# EAGLE design Ultrasonic Array_8x8 (EAGLE 6.3)
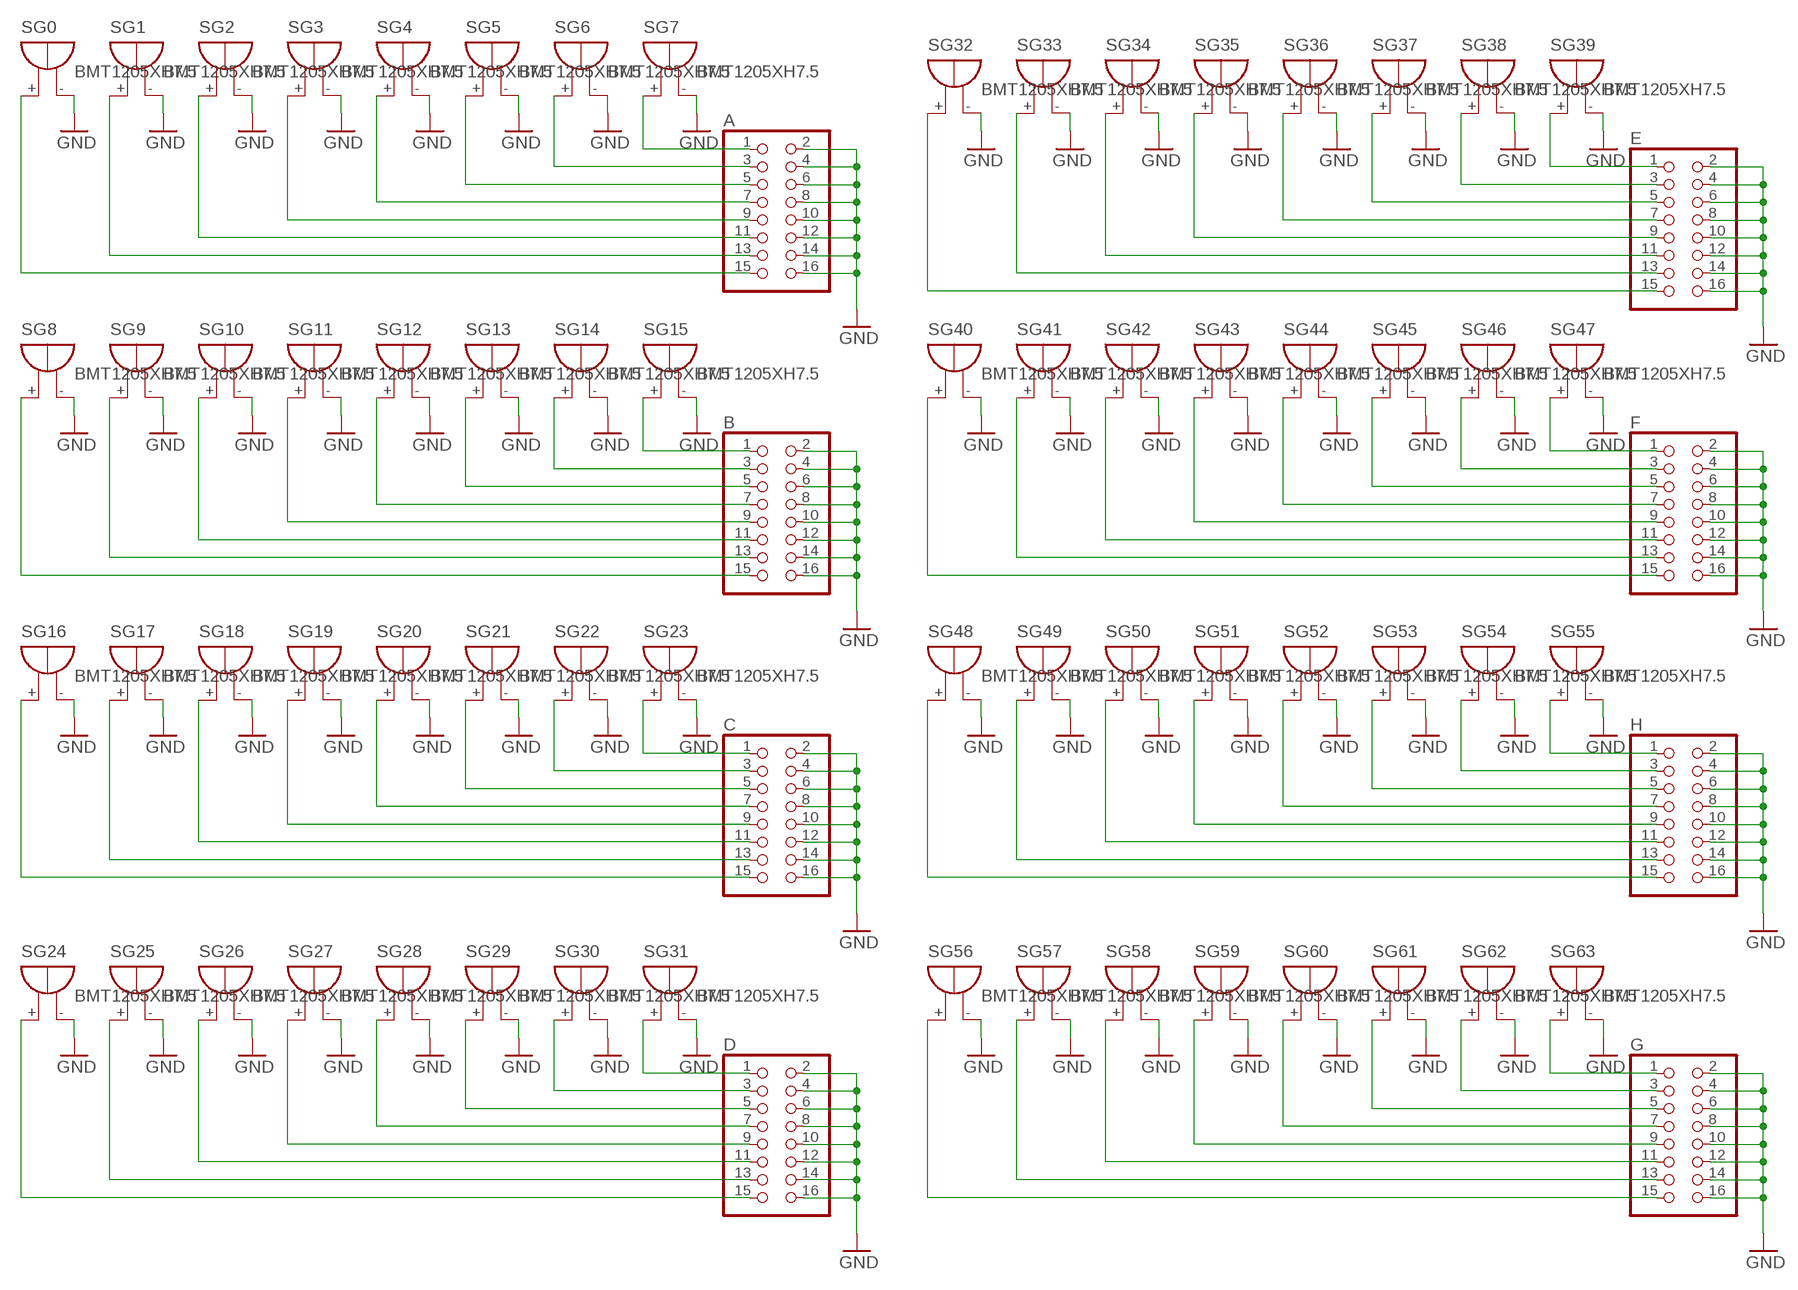
[diagram p0: schematic, sheet 1]

## Parts
A  PINHD-2X8  [2X08]
B  PINHD-2X8  [2X08]
C  PINHD-2X8  [2X08]
D  PINHD-2X8  [2X08]
E  PINHD-2X8  [2X08]
F  PINHD-2X8  [2X08]
G  PINHD-2X8  [2X08]
H  PINHD-2X8  [2X08]
SG0  BMT1205XH7.5  [BMT1205XH7.5]
SG1  BMT1205XH7.5  [BMT1205XH7.5]
SG2  BMT1205XH7.5  [BMT1205XH7.5]
SG3  BMT1205XH7.5  [BMT1205XH7.5]
SG4  BMT1205XH7.5  [BMT1205XH7.5]
SG5  BMT1205XH7.5  [BMT1205XH7.5]
SG6  BMT1205XH7.5  [BMT1205XH7.5]
SG7  BMT1205XH7.5  [BMT1205XH7.5]
SG8  BMT1205XH7.5  [BMT1205XH7.5]
SG9  BMT1205XH7.5  [BMT1205XH7.5]
SG10  BMT1205XH7.5  [BMT1205XH7.5]
SG11  BMT1205XH7.5  [BMT1205XH7.5]
SG12  BMT1205XH7.5  [BMT1205XH7.5]
SG13  BMT1205XH7.5  [BMT1205XH7.5]
SG14  BMT1205XH7.5  [BMT1205XH7.5]
SG15  BMT1205XH7.5  [BMT1205XH7.5]
SG16  BMT1205XH7.5  [BMT1205XH7.5]
SG17  BMT1205XH7.5  [BMT1205XH7.5]
SG18  BMT1205XH7.5  [BMT1205XH7.5]
SG19  BMT1205XH7.5  [BMT1205XH7.5]
SG20  BMT1205XH7.5  [BMT1205XH7.5]
SG21  BMT1205XH7.5  [BMT1205XH7.5]
SG22  BMT1205XH7.5  [BMT1205XH7.5]
SG23  BMT1205XH7.5  [BMT1205XH7.5]
SG24  BMT1205XH7.5  [BMT1205XH7.5]
SG25  BMT1205XH7.5  [BMT1205XH7.5]
SG26  BMT1205XH7.5  [BMT1205XH7.5]
SG27  BMT1205XH7.5  [BMT1205XH7.5]
SG28  BMT1205XH7.5  [BMT1205XH7.5]
SG29  BMT1205XH7.5  [BMT1205XH7.5]
SG30  BMT1205XH7.5  [BMT1205XH7.5]
SG31  BMT1205XH7.5  [BMT1205XH7.5]
SG32  BMT1205XH7.5  [BMT1205XH7.5]
SG33  BMT1205XH7.5  [BMT1205XH7.5]
SG34  BMT1205XH7.5  [BMT1205XH7.5]
SG35  BMT1205XH7.5  [BMT1205XH7.5]
SG36  BMT1205XH7.5  [BMT1205XH7.5]
SG37  BMT1205XH7.5  [BMT1205XH7.5]
SG38  BMT1205XH7.5  [BMT1205XH7.5]
SG39  BMT1205XH7.5  [BMT1205XH7.5]
SG40  BMT1205XH7.5  [BMT1205XH7.5]
SG41  BMT1205XH7.5  [BMT1205XH7.5]
SG42  BMT1205XH7.5  [BMT1205XH7.5]
SG43  BMT1205XH7.5  [BMT1205XH7.5]
SG44  BMT1205XH7.5  [BMT1205XH7.5]
SG45  BMT1205XH7.5  [BMT1205XH7.5]
SG46  BMT1205XH7.5  [BMT1205XH7.5]
SG47  BMT1205XH7.5  [BMT1205XH7.5]
SG48  BMT1205XH7.5  [BMT1205XH7.5]
SG49  BMT1205XH7.5  [BMT1205XH7.5]
SG50  BMT1205XH7.5  [BMT1205XH7.5]
SG51  BMT1205XH7.5  [BMT1205XH7.5]
SG52  BMT1205XH7.5  [BMT1205XH7.5]
SG53  BMT1205XH7.5  [BMT1205XH7.5]
SG54  BMT1205XH7.5  [BMT1205XH7.5]
SG55  BMT1205XH7.5  [BMT1205XH7.5]
SG56  BMT1205XH7.5  [BMT1205XH7.5]
SG57  BMT1205XH7.5  [BMT1205XH7.5]
SG58  BMT1205XH7.5  [BMT1205XH7.5]
SG59  BMT1205XH7.5  [BMT1205XH7.5]
SG60  BMT1205XH7.5  [BMT1205XH7.5]
SG61  BMT1205XH7.5  [BMT1205XH7.5]
SG62  BMT1205XH7.5  [BMT1205XH7.5]
SG63  BMT1205XH7.5  [BMT1205XH7.5]

## Nets
GND: A.2 A.4 A.6 A.8 A.10 A.12 A.14 A.16 B.2 B.4 B.6 B.8 B.10 B.12 B.14 B.16 C.2 C.4 C.6 C.8 C.10 C.12 C.14 C.16 D.2 D.4 D.6 D.8 D.10 D.12 D.14 D.16 E.2 E.4 E.6 E.8 E.10 E.12 E.14 E.16 F.2 F.4 F.6 F.8 F.10 F.12 F.14 F.16 G.2 G.4 G.6 G.8 G.10 G.12 G.14 G.16 H.2 H.4 H.6 H.8 H.10 H.12 H.14 H.16 SG0.- SG1.- SG2.- SG3.- SG4.- SG5.- SG6.- SG7.- SG8.- SG9.- SG10.- SG11.- SG12.- SG13.- SG14.- SG15.- SG16.- SG17.- SG18.- SG19.- SG20.- SG21.- SG22.- SG23.- SG24.- SG25.- SG26.- SG27.- SG28.- SG29.- SG30.- SG31.- SG32.- SG33.- SG34.- SG35.- SG36.- SG37.- SG38.- SG39.- SG40.- SG41.- SG42.- SG43.- SG44.- SG45.- SG46.- SG47.- SG48.- SG49.- SG50.- SG51.- SG52.- SG53.- SG54.- SG55.- SG56.- SG57.- SG58.- SG59.- SG60.- SG61.- SG62.- SG63.-
N$1: A.1 SG7.+
N$2: A.3 SG6.+
N$3: A.5 SG5.+
N$4: A.7 SG4.+
N$5: A.9 SG3.+
N$6: A.11 SG2.+
N$7: A.13 SG1.+
N$8: A.15 SG0.+
N$17: B.1 SG15.+
N$18: B.3 SG14.+
N$19: B.5 SG13.+
N$20: B.7 SG12.+
N$21: B.9 SG11.+
N$22: B.11 SG10.+
N$23: B.13 SG9.+
N$24: B.15 SG8.+
N$34: C.1 SG23.+
N$35: C.3 SG22.+
N$36: C.5 SG21.+
N$37: C.7 SG20.+
N$38: C.9 SG19.+
N$39: C.11 SG18.+
N$40: C.13 SG17.+
N$41: C.15 SG16.+
N$50: D.1 SG31.+
N$51: D.3 SG30.+
N$52: D.5 SG29.+
N$53: D.7 SG28.+
N$54: D.9 SG27.+
N$55: D.11 SG26.+
N$56: D.13 SG25.+
N$57: D.15 SG24.+
N$66: E.1 SG39.+
N$67: E.3 SG38.+
N$68: E.5 SG37.+
N$69: E.7 SG36.+
N$70: E.9 SG35.+
N$71: E.11 SG34.+
N$72: E.13 SG33.+
N$73: E.15 SG32.+
N$82: F.1 SG47.+
N$83: F.3 SG46.+
N$84: F.5 SG45.+
N$85: F.7 SG44.+
N$86: F.9 SG43.+
N$87: F.11 SG42.+
N$88: F.13 SG41.+
N$89: F.15 SG40.+
N$98: H.1 SG55.+
N$99: H.3 SG54.+
N$100: H.5 SG53.+
N$101: H.7 SG52.+
N$102: H.9 SG51.+
N$103: H.11 SG50.+
N$104: H.13 SG49.+
N$105: H.15 SG48.+
N$114: G.1 SG63.+
N$115: G.3 SG62.+
N$116: G.5 SG61.+
N$117: G.7 SG60.+
N$118: G.9 SG59.+
N$119: G.11 SG58.+
N$120: G.13 SG57.+
N$121: G.15 SG56.+

## Library data of the parts
A B C D E F G H = pinhead:PINHD-2X8: PIN HEADER
SG0 SG1-SG63 = buzzer_custom:BMT1205XH7.5: MAGNETIC TRANSDUCER Source: Http:www.be-star.com; OC_FARNELL: unknown; OC_NEWARK: unknown

## Board
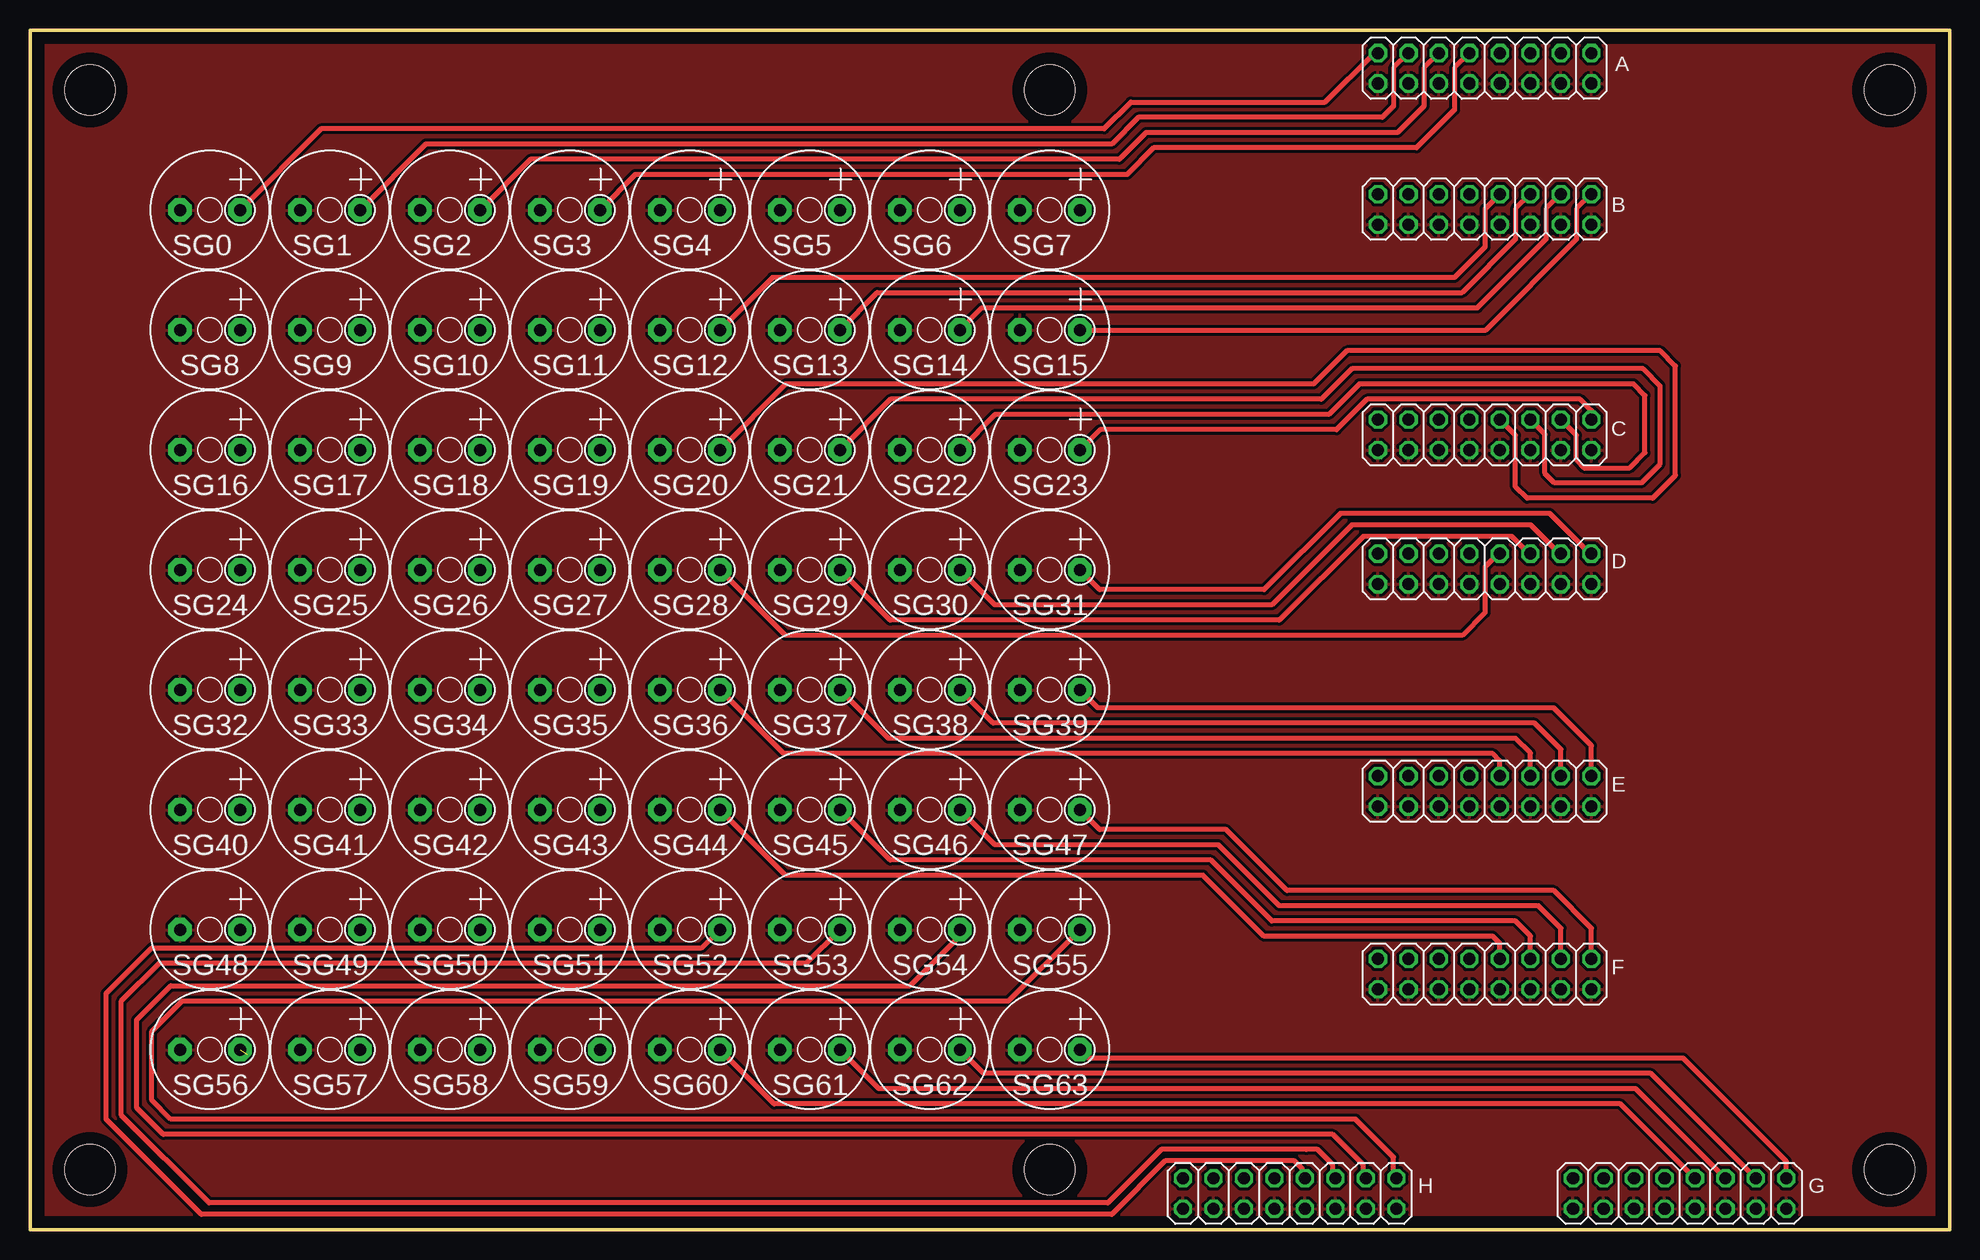
[diagram p1: board, top side]
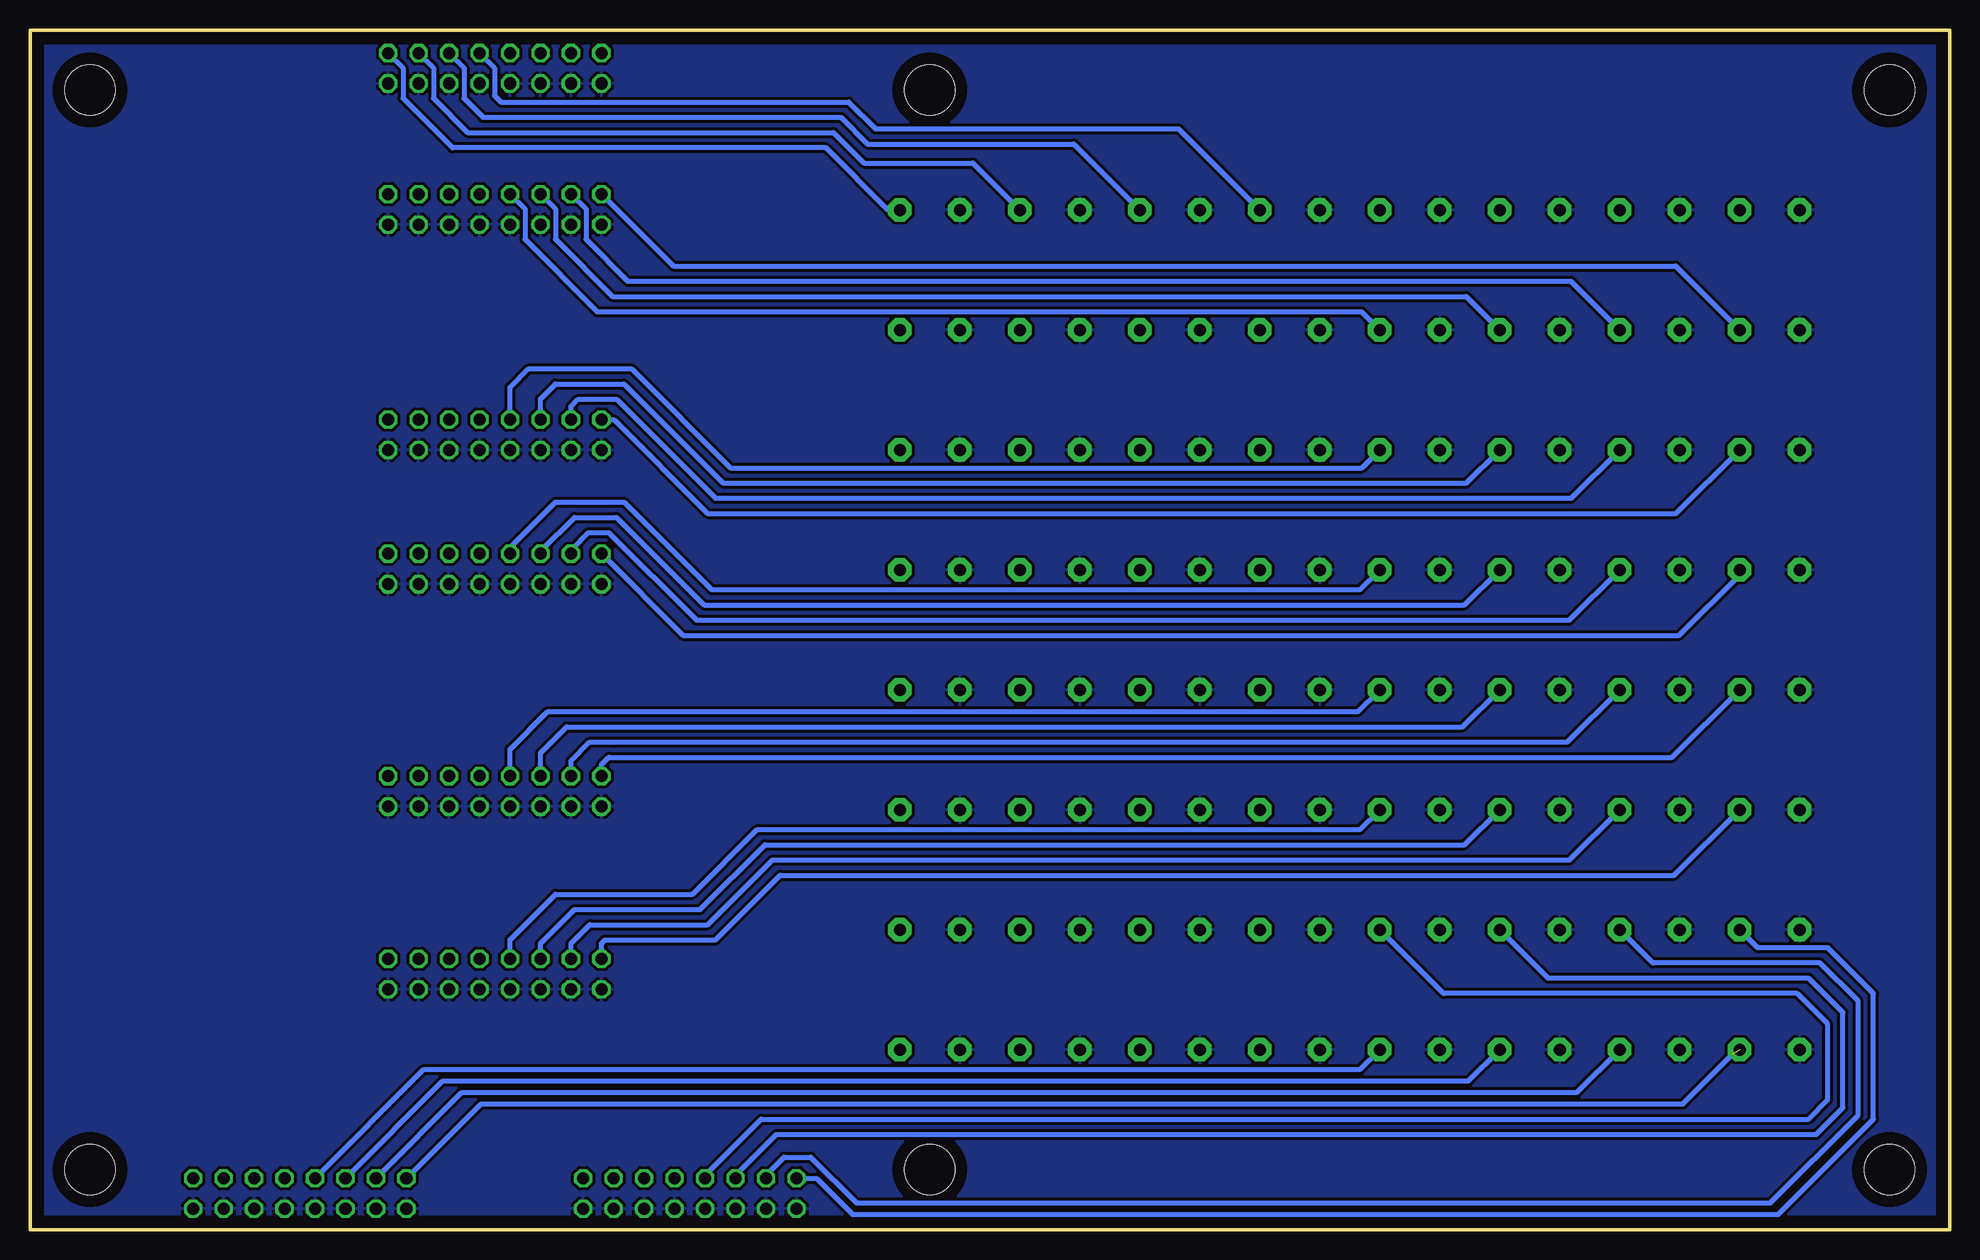
[diagram p2: board, bottom side, seen from below]

Size 160 x 100 mm. Coordinates in mm from the lower left corner, seen from the top.
Outline: 0,0 160,0 160,100 0,100 0,0
Copper layers (1*16): Top 0.035mm / dielectric 1.5mm / Bottom 0.035mm
Design rules "default *": minimum track width 10mil, minimum drill 24mil, track to track 8mil, track to pad 8mil, pad to pad 8mil, via to via 8mil, smd to smd 8mil, copper to edge 40mil, drill to drill 8mil, minimum pad ring 10mil, minimum via ring 8mil, stop-mask expansion 4mil, vias tented up to drill 0mil, thermal gap 10mil
Holes 4.2 mm at 5,95 85,95 5,5 85,5 155,95 155,5

### Footprints (pad centres in the part's own frame; a part is rotated, then mirrored left to right if it is on the bottom)
2X08 = drill 1.016 octagon: 1 -8.89,-1.27; 2 -8.89,1.27; 3 -6.35,-1.27; 4 -6.35,1.27; 5 -3.81,-1.27; 6 -3.81,1.27; 7 -1.27,-1.27; 8 -1.27,1.27; 9 1.27,-1.27; 10 1.27,1.27; 11 3.81,-1.27; 12 3.81,1.27; 13 6.35,-1.27; 14 6.35,1.27; 15 8.89,-1.27; 16 8.89,1.27
BMT1205XH7.5 = drill 1 pad 1.93 octagon: + 2.5,0; - -2.5,0

### Placement (x,y rotation side)
A  121.26,96.8 180 top
B  121.26,85.04 180 top
C  121.26,66.25 180 top
D  121.26,55.07 180 top
E  121.26,36.53 180 top
F  121.26,21.29 180 top
G  137.51,3 180 top
H  105,3 180 top
SG0  15,85 0 top
SG1  25,85 0 top
SG2  35,85 0 top
SG3  45,85 0 top
SG4  55,85 0 top
SG5  65,85 0 top
SG6  75,85 0 top
SG7  85,85 0 top
SG8  15,75 0 top
SG9  25,75 0 top
SG10  35,75 0 top
SG11  45,75 0 top
SG12  55,75 0 top
SG13  65,75 0 top
SG14  75,75 0 top
SG15  85,75 0 top
SG16  15,65 0 top
SG17  25,65 0 top
SG18  35,65 0 top
SG19  45,65 0 top
SG20  55,65 0 top
SG21  65,65 0 top
SG22  75,65 0 top
SG23  85,65 0 top
SG24  15,55 0 top
SG25  25,55 0 top
SG26  35,55 0 top
SG27  45,55 0 top
SG28  55,55 0 top
SG29  65,55 0 top
SG30  75,55 0 top
SG31  85,55 0 top
SG32  15,45 0 top
SG33  25,45 0 top
SG34  35,45 0 top
SG35  45,45 0 top
SG36  55,45 0 top
SG37  65,45 0 top
SG38  75,45 0 top
SG39  85,45 0 top
SG40  15,35 0 top
SG41  25,35 0 top
SG42  35,35 0 top
SG43  45,35 0 top
SG44  55,35 0 top
SG45  65,35 0 top
SG46  75,35 0 top
SG47  85,35 0 top
SG48  15,25 0 top
SG49  25,25 0 top
SG50  35,25 0 top
SG51  45,25 0 top
SG52  55,25 0 top
SG53  65,25 0 top
SG54  75,25 0 top
SG55  85,25 0 top
SG56  15,15 0 top
SG57  25,15 0 top
SG58  35,15 0 top
SG59  45,15 0 top
SG60  55,15 0 top
SG61  65,15 0 top
SG62  75,15 0 top
SG63  85,15 0 top

### Tracks (layer width: path | path; a pad name or v marks a point on that pad's centre or on a via)
GND
  pour Bottom (isolate 0.254): 0,0 0,100 160,100 160,0
  pour Top (isolate 0.254): 0,0 0,100 160,100 160,0
N$1
  Bottom 0.406: A.1 128.91,96.84 128.91,94.3 124.78,90.17 93.66,90.17 88.49,85 SG7.+
N$2
  Bottom 0.406: A.3 126.36,96.84 126.36,94.3 123.51,91.44 93.03,91.44 90.49,88.9 81.4,88.9 SG6.+
N$3
  Bottom 0.406: A.5 123.83,96.84 123.83,94.3 122.24,92.71 92.39,92.71 90.17,90.49 72.99,90.49 SG5.+
N$4
  Bottom 0.406: A.7 121.29,96.84 121.28,96.84 121.28,94.54 120.73,93.98 91.76,93.98 89.53,91.76 64.26,91.76 SG4.+
N$5
  Top 0.406: A.9 118.75,96.84 118.75,93.34 115.57,90.17 93.66,90.17 91.44,87.95 50.45,87.95 SG3.+
N$6
  Top 0.406: A.11 116.2,96.84 116.2,93.66 113.98,91.44 93.03,91.44 90.81,89.22 41.72,89.22 SG2.+
N$7
  Top 0.406: A.13 113.67,96.84 113.67,93.66 112.71,92.71 92.39,92.71 90.17,90.49 32.99,90.49 SG1.+
N$8
  Top 0.406: SG0.+ 24.26,91.76 89.53,91.76 91.76,93.98 107.95,93.98 112.04,98.07 A.15
N$17
  Top 0.406: B.1 130.13,86.31 128.91,85.09 128.91,82.55 121.36,75 SG15.+
N$18
  Top 0.406: B.3 127.59,86.31 126.36,85.09 126.36,82.55 120.65,76.83 79.33,76.83 SG14.+
N$19
  Top 0.406: B.5 125.05,86.31 123.83,85.09 123.83,82.55 119.38,78.11 70.61,78.11 SG13.+
N$20
  Top 0.406: B.7 121.28,85.07 121.28,81.92 118.75,79.38 61.88,79.38 SG12.+
N$21
  Bottom 0.406: B.9 119.97,86.31 118.75,85.09 118.75,82.55 112.71,76.52 49.02,76.52 SG11.+
N$22
  Bottom 0.406: B.11 117.43,86.31 116.2,85.09 116.2,82.55 111.44,77.79 40.29,77.79 SG10.+
N$23
  Bottom 0.406: B.13 114.89,86.31 113.67,85.09 113.67,82.55 110.17,79.06 31.56,79.06 SG9.+
N$24
  Bottom 0.406: B.15 112.35,86.31 106.36,80.33 22.83,80.33 SG8.+
N$34
  Top 0.406: C.1 130.15,68.29 129.22,69.22 111.44,69.22 108.9,66.67 89.17,66.67 SG23.+
N$35
  Top 0.406: SG22.+ 80.44,67.94 108.27,67.94 110.81,70.48 133.67,70.48 134.62,69.53 134.62,64.77 133.35,63.5 129.54,63.5 128.91,64.14 128.91,66.22 C.3
N$36
  Top 0.406: SG21.+ 71.72,69.22 107.63,69.22 110.17,71.75 134.46,71.75 135.89,70.33 135.89,63.82 134.3,62.23 127.08,62.23 126.29,63.02 126.29,66.3 C.5
N$37
  Top 0.406: SG20.+ 62.98,70.48 107,70.48 109.78,73.26 135.89,73.26 137.16,71.99 137.16,62.87 135.25,60.96 124.78,60.96 123.83,61.91 123.83,66.22 C.7
N$38
  Bottom 0.406: C.9 119.99,70.2 118.43,71.75 109.86,71.75 101.6,63.5 49,63.5 SG19.+
N$39
  Bottom 0.406: C.11 117.45,69.24 116.2,70.48 110.49,70.48 102.23,62.23 40.27,62.23 SG18.+
N$40
  Bottom 0.406: C.13 114.91,68.61 114.3,69.22 111.12,69.22 102.87,60.96 31.54,60.96 SG17.+
N$41
  Bottom 0.406: C.15 111.33,67.52 103.5,59.69 22.81,59.69 SG16.+
N$50
  Top 0.406: D.1 130.03,56.34 126.68,59.69 109.22,59.69 102.87,53.34 89.16,53.34 SG31.+
N$51
  Top 0.406: D.3 127.49,56.34 125.09,58.74 110.17,58.74 103.5,52.07 80.43,52.07 SG30.+
N$52
  Top 0.406: D.5 124.95,56.34 123.51,57.78 111.12,57.78 104.14,50.8 71.7,50.8 SG29.+
N$53
  Top 0.406: D.7 122.38,56.34 121.28,55.24 121.28,51.44 119.38,49.53 62.97,49.53 SG28.+
N$54
  Bottom 0.406: SG27.+ 49.16,53.34 103.19,53.34 110.49,60.64 116.2,60.64 119.99,56.86 D.9
N$55
  Bottom 0.406: SG26.+ 40.43,52.07 103.82,52.07 111.12,59.37 114.62,59.37 117.45,56.54 D.11
N$56
  Bottom 0.406: SG25.+ 31.7,50.8 104.46,50.8 111.76,58.1 113.46,58.1 114.91,56.66 D.13
N$57
  Bottom 0.406: D.15 105.55,49.53 22.54,49.53 17.5,54.57 SG24.+
N$66
  Top 0.406: E.1 130.15,40.35 127,43.5 89,43.5 SG39.+
N$67
  Top 0.406: E.3 127.61,40.03 125.41,42.23 80.27,42.23 SG38.+
N$68
  Top 0.406: E.5 125.07,39.72 123.83,40.96 71.54,40.96 SG37.+
N$69
  Top 0.406: E.7 122.53,39.08 121.92,39.69 62.81,39.69 SG36.+
N$70
  Bottom 0.406: E.9 119.99,40.03 116.84,43.18 49.32,43.18 SG35.+
N$71
  Bottom 0.406: E.11 117.45,39.72 115.25,41.91 40.59,41.91 SG34.+
N$72
  Bottom 0.406: E.13 114.91,39.08 113.35,40.64 31.86,40.64 SG33.+
N$73
  Bottom 0.406: E.15 112.37,38.76 111.76,39.37 23.13,39.37 SG32.+
N$82
  Top 0.406: F.1 130.15,25.11 127,28.26 104.78,28.26 99.69,33.34 89.16,33.34 SG47.+
N$83
  Top 0.406: F.3 127.61,25.11 125.73,26.99 104.14,26.99 99.06,32.07 80.43,32.07 SG46.+
N$84
  Top 0.406: F.5 125.07,24.48 123.83,25.72 103.5,25.72 98.42,30.8 71.7,30.8 SG45.+
N$85
  Top 0.406: F.7 122.53,23.84 121.92,24.45 102.87,24.45 97.79,29.53 62.97,29.53 SG44.+
N$86
  Bottom 0.406: F.9 119.99,24.16 116.2,27.94 104.78,27.94 99.38,33.34 49.16,33.34 SG43.+
N$87
  Bottom 0.406: F.11 117.45,23.84 114.62,26.67 104.14,26.67 98.74,32.07 40.43,32.07 SG42.+
N$88
  Bottom 0.406: F.13 114.91,23.84 113.35,25.4 103.5,25.4 98.11,30.8 31.7,30.8 SG41.+
N$89
  Bottom 0.406: F.15 112.37,23.84 112.08,24.13 102.87,24.13 97.47,29.53 22.97,29.53 SG40.+
N$98
  Top 0.406: SG55.+ 81.55,19.05 12.7,19.05 10.16,16.51 10.16,10.79 11.75,9.21 110.49,9.21 113.67,6.03 113.67,4.5 H.1
N$99
  Top 0.406: H.3 111.12,4.5 111.12,5.4 108.58,7.94 11.11,7.94 8.89,10.16 8.89,17.46 11.75,20.32 73.34,20.32 77.5,24.48 SG54.+
N$100
  Top 0.406: H.5 108.58,4.5 108.58,5.08 108.58,5.4 107.31,6.67 106.36,6.67 106.41,6.67 94.3,6.67 89.85,2.22 14.92,2.22 7.62,9.53 7.62,19.05 10.79,22.23 64.72,22.23 SG53.+
N$101
  Top 0.406: H.7 106.05,4.5 106.05,5.08 105.41,5.71 94.61,5.71 90.17,1.27 14.29,1.27 6.35,9.21 6.35,19.68 10.16,23.5 55.99,23.5 SG52.+
N$102
  Bottom 0.406: H.9 103.73,4.54 99.06,9.21 11.75,9.21 10.16,10.79 10.16,17.14 12.7,19.68 42.19,19.68 SG51.+
N$103
  Bottom 0.406: H.11 101.19,4.54 97.79,7.94 11.11,7.94 8.89,10.16 8.89,18.1 11.75,20.95 33.45,20.95 SG50.+
N$104
  Bottom 0.406: H.13 98.65,4.54 97.16,6.03 94.93,6.03 91.12,2.22 14.92,2.22 7.62,9.53 7.62,19.05 10.79,22.23 24.73,22.23 SG49.+
N$105
  Bottom 0.406: H.15 94.44,4.27 91.44,1.27 14.29,1.27 6.35,9.21 6.35,19.68 10.16,23.5 15.99,23.5 SG48.+
N$114
  Top 0.406: G.1 146.4,5.68 137.79,14.29 88.21,14.29 SG63.+
N$115
  Top 0.406: G.3 135.11,13.02 79.48,13.02 SG62.+
N$116
  Top 0.406: G.5 133.84,11.75 70.75,11.75 SG61.+
N$117
  Top 0.406: G.7 132.57,10.48 62.02,10.48 SG60.+
N$118
  Bottom 0.406: G.9 127.18,13.34 49.16,13.34 SG59.+
N$119
  Bottom 0.406: G.11 125.59,12.38 40.12,12.38 SG58.+
N$120
  Bottom 0.406: G.13 124,11.43 31.07,11.43 SG57.+
N$121  (1 unrouted)
  Bottom 0.406: G.15 122.42,10.48 22.23,10.48 18.1,14.61